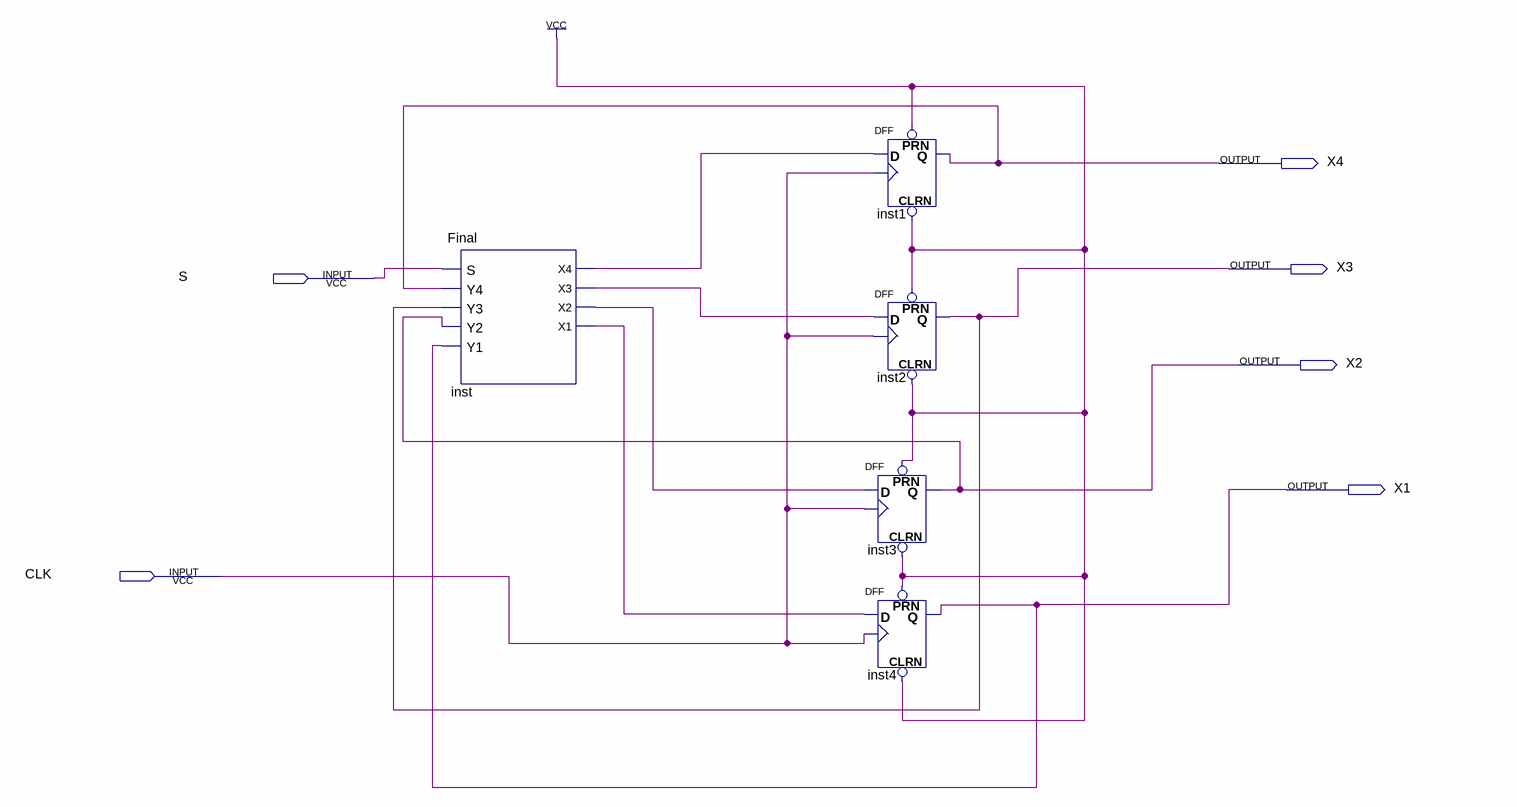
[diagram p0: schematic sheet]
// Quartus schematic FinalPro.bdf as structural Verilog: 5 symbols, 6 pins
module FinalPro (
  input  S,
  input  CLK,
  output X4,
  output X3,
  output X2,
  output X1
);

  wire inst_x1, inst_x2, inst_x3, inst_x4;

  Final inst (.S(S), .Y4(X4), .Y3(X3), .Y2(X2), .Y1(X1), .X4(inst_x4), .X3(inst_x3), .X2(inst_x2), .X1(inst_x1));
  DFF inst3 (.CLRN(1'b1), .CLK(CLK), .D(inst_x2), .PRN(1'b1), .Q(X2));
  DFF inst4 (.CLRN(1'b1), .CLK(CLK), .D(inst_x1), .PRN(1'b1), .Q(X1));
  DFF inst1 (.CLRN(1'b1), .CLK(CLK), .D(inst_x4), .PRN(1'b1), .Q(X4));
  DFF inst2 (.CLRN(1'b1), .CLK(CLK), .D(inst_x3), .PRN(1'b1), .Q(X3));
endmodule
